# Altium schematic sheet MS5611.SchDoc
size A4
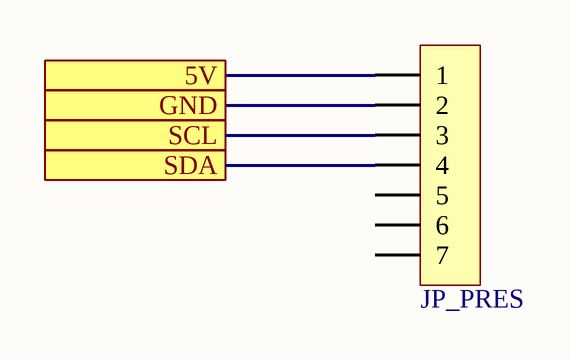
[diagram p0: MS5611.SchDoc]

## Parts
JP_PRES  HDR-1X7  [HDR2.54-LI-7P]  (value not drawn)

## Ports
5V, GND, SCL, SDA

## Nets
5V: JP_PRES.1 ; port 5V
GND: JP_PRES.2 ; port GND
SCL: JP_PRES.3 ; port SCL
SDA: JP_PRES.4 ; port SDA

Not connected (* = marked no-connect by the designer): JP_PRES 5 6 7

## Library data of the parts
JP_PRES = Header 7: 7P接插件; 版权归属: 源创客; BOM名称: 7P接插件; 学习资源: www.ooocke.com